# Altium project bootleg-alps.PrjPcb
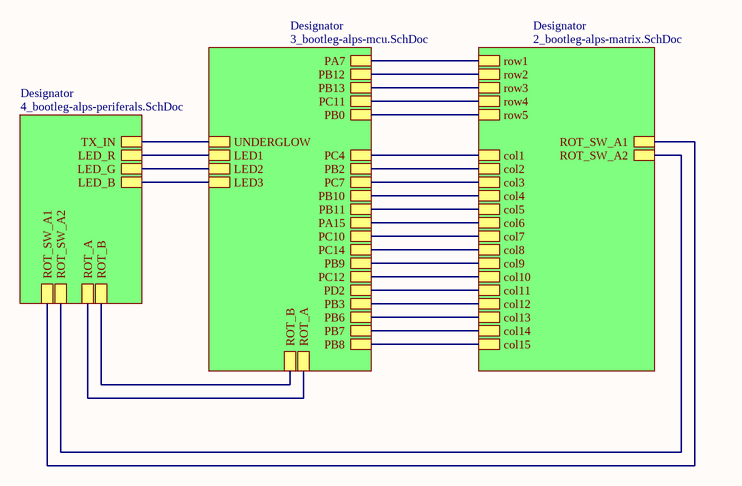
[diagram p0: 1_bootleg-alps_top.SchDoc]
ProjectTitle: bootlegs; Revision: B2 - MX
4 sheets, 188 parts. Net scope: hierarchical (ports join the sheet entries above them; power ports are global).
Board file: bootleg-alps.PcbDoc
Sheets:
  1_bootleg-alps_top.SchDoc
    Designator = 3_bootleg-alps-mcu.SchDoc
    Designator = 2_bootleg-alps-matrix.SchDoc
    Designator = 4_bootleg-alps-periferals.SchDoc

## Sheet 1_bootleg-alps_top.SchDoc: =ProjectTitle
size A4; Address1: github.com/4pplet/bootlegs; Address2: Licence: CERN-OHL-S; Address4: www.4pplet.com; Revision: B2 - MX; SheetNumber: 1; SheetTotal: 4; ProjectName: waffling60

### Sub-sheets
Designator = 3_bootleg-alps-mcu.SchDoc: PB10, PB3, PB8, PB9, PC10, PB0, PC11, PB7, PA15, PB6, PC14, PB13, PD2, UNDERGLOW, LED2, LED1, LED3, PC12, PB2, PB12, PB11, ROT_B, ROT_A, PA7, PC7, PC4
Designator = 2_bootleg-alps-matrix.SchDoc: col5, col7, col3, col1, row3, row1, row4, row2, row5, col4, col2, col6, col14, ROT_SW_A1, col10, ROT_SW_A2, col8, col9, col15, col11, col12, col13
Designator = 4_bootleg-alps-periferals.SchDoc: TX_IN, ROT_A, ROT_B, LED_B, LED_R, LED_G, ROT_SW_A1, ROT_SW_A2

### Nets
col1: sheet Designator/PC4, sheet Designator/col1
col2: sheet Designator/PB2, sheet Designator/col2
col3: sheet Designator/PC7, sheet Designator/col3
col4: sheet Designator/PB10, sheet Designator/col4
col5: sheet Designator/PB11, sheet Designator/col5
col6: sheet Designator/PA15, sheet Designator/col6
col7: sheet Designator/PC10, sheet Designator/col7
col8: sheet Designator/PC14, sheet Designator/col8
col9: sheet Designator/PB9, sheet Designator/col9
col10: sheet Designator/PC12, sheet Designator/col10
col11: sheet Designator/PD2, sheet Designator/col11
col12: sheet Designator/PB3, sheet Designator/col12
col13: sheet Designator/PB6, sheet Designator/col13
col14: sheet Designator/PB7, sheet Designator/col14
col15: sheet Designator/PB8, sheet Designator/ROT_SW_A2, sheet Designator/col15, sheet Designator/ROT_SW_A2
ENC_A: sheet Designator/ROT_A, sheet Designator/ROT_A
ENC_B: sheet Designator/ROT_B, sheet Designator/ROT_B
PA7: sheet Designator/PA7, sheet Designator/row1
PA8: sheet Designator/LED3, sheet Designator/LED_B
PA9: sheet Designator/LED1, sheet Designator/LED_R
PA10: sheet Designator/LED2, sheet Designator/LED_G
PB0: sheet Designator/PB0, sheet Designator/row5
PB12: sheet Designator/PB12, sheet Designator/row2
PB13: sheet Designator/PB13, sheet Designator/row3
PC11: sheet Designator/PC11, sheet Designator/row4
ROT_SW_A1: sheet Designator/ROT_SW_A1, sheet Designator/ROT_SW_A1
NetLED402_4: sheet Designator/UNDERGLOW, sheet Designator/TX_IN

### Notes on the sheet
- Title
- Size:
- Date:
- A4
- Number:
- Time:
- Revision:
- Sheet
- of
- File:

## Sheet 3_bootleg-alps-mcu.SchDoc: =ProjectTitle
size A4; Address1: github.com/4pplet/bootlegs; Address2: Licence: CERN-OHL-S; Address4: www.4pplet.com; Revision: B2 - MX; SheetNumber: 3; SheetTotal: 4
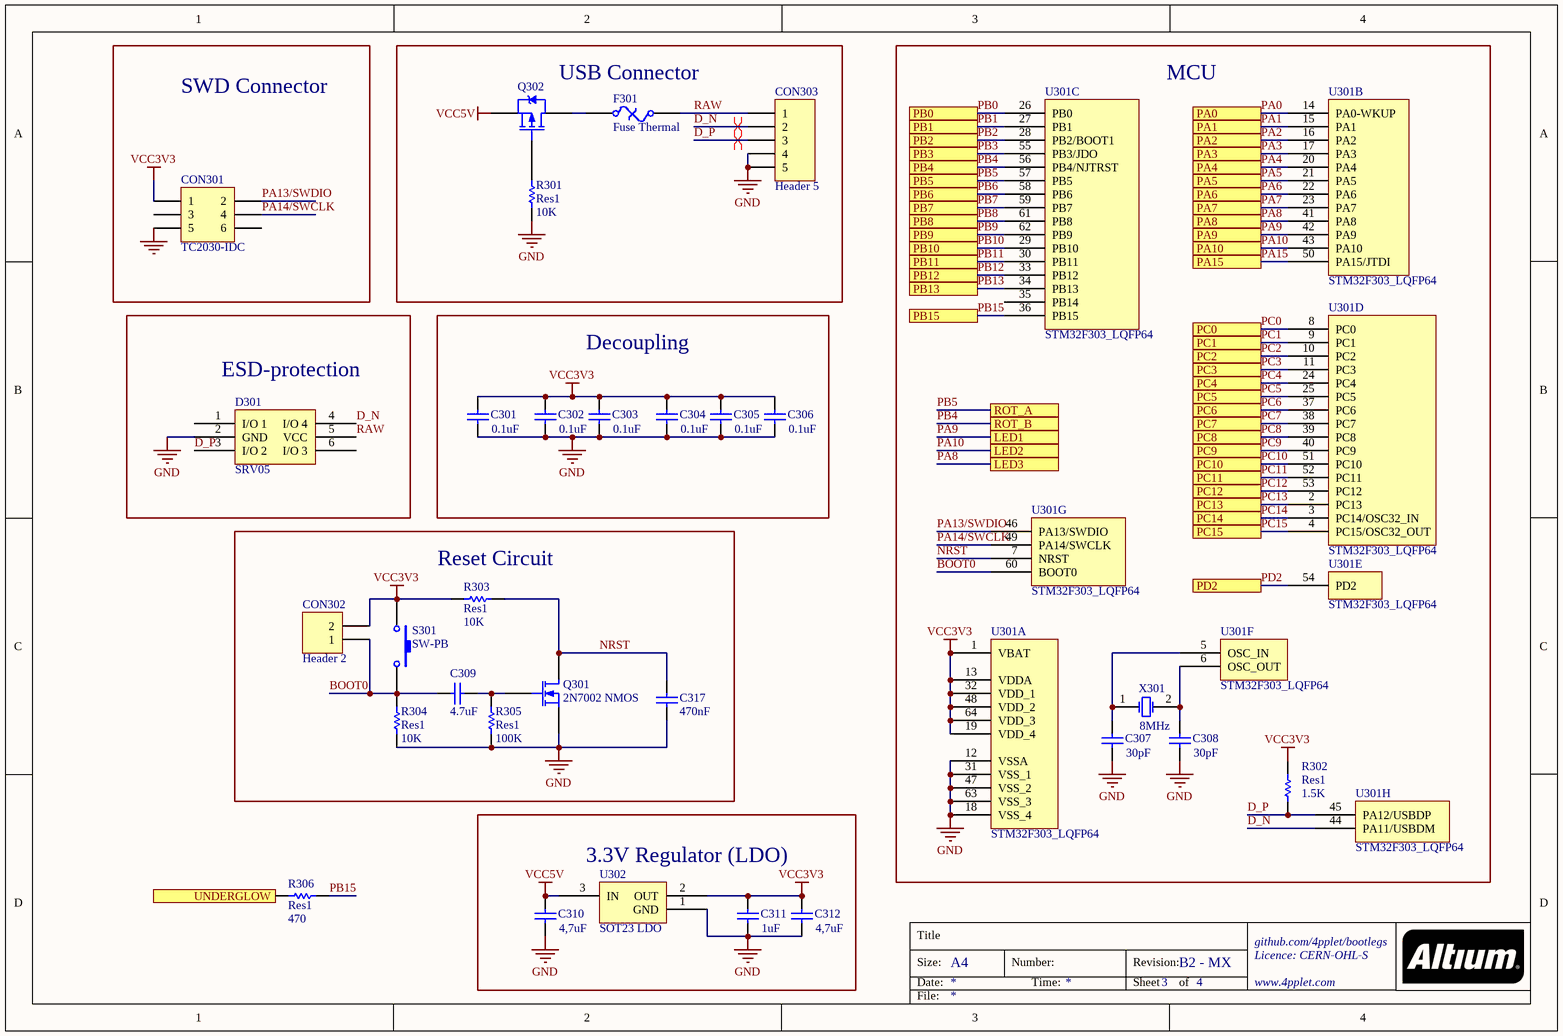
[diagram p1: 3_bootleg-alps-mcu.SchDoc]

### Parts
C301  value 0.1uF  [C0603[1608]]
C302  value 0.1uF  [C0603[1608]]
C303  value 0.1uF  [C0603[1608]]
C304  value 0.1uF  [C0603[1608]]
C305  value 0.1uF  [C0603[1608]]
C306  value 0.1uF  [C0603[1608]]
C307  value 30pF  [C0603[1608]]
C308  value 30pF  [C0603[1608]]
C309  value 4.7uF  [C0603[1608]]
C310  value 4,7uF  [C0603[1608]]
C311  value 1uF  [C0603[1608]]
C312  value 4,7uF  [C0603[1608]]
C317  value 470nF  [C0603[1608]]
CON301  TC2030-IDC  [TC2030-IDC-NL]  (no BOM)
CON302  Header 2  [HDR1X2]  (no BOM)
CON303  Header 5  [JST SM04B-SRSS-TB]
D301  SRV05  [SOT-23-6]
F301  Fuse Thermal  [C1206[3216]]
Q301  2N7002 NMOS  [SOT-23-3]
Q302  PMOS-2  [SOT-23-3]  (value not drawn)
R301  Res1  value 10K  [R0603[1608]]
R302  Res1  value 1.5K  [R0603[1608]]
R303  Res1  value 10K  [R0603[1608]]
R304  Res1  value 10K  [R0603[1608]]
R305  Res1  value 100K  [R0603[1608]]
R306  Res1  value 470  [R0603[1608]]
S301  SW-PB  [XKB Switch]
U301  STM32F303_LQFP64  [STM32 - LQFP64, 10x10mm]  (parts A,B,C,D,E,F,G,H of 8)
U302  SOT23 LDO  [SOT-23-3]
X301  value 8MHz  [CTS 445-series crystal]  (hidden comment: XTAL)

### Blocks framed on the sheet
SWD Connector: CON301
USB Connector: CON303 F301 Q302 R301
MCU: C307 C308 R302 U301 X301
ESD-protection: D301
Decoupling: C301-C306
Reset Circuit: C309 C317 CON302 Q301 R303-R305 S301
3.3V Regulator (LDO): C310-C312 U302

### Ports
LED1, LED2, LED3, PA0, PA1, PA2, PA3, PA4, PA5, PA6, PA7, PA8, PA9, PA10, PA15, PB0, PB1, PB2, PB3, PB4, PB5, PB6, PB7, PB8, PB9, PB10, PB11, PB12, PB13, PB15, PC0, PC1, PC2, PC3, PC4, PC5, PC6, PC7, PC8, PC9, PC10, PC11, PC12, PC13, PC14, PC15, PD2, ROT_A, ROT_B, UNDERGLOW

### Nets
GND: C301.1 C302.1 C303.1 C304.1 C305.1 C306.1 C307.1 C308.1 C310.1 C311.1 C312.1 C317.2 CON301.5 CON303.4 CON303.5 D301.2(GND) Q301.2(S) R301.2 R304.2 R305.2 U301.12(VSSA) U301.18(VSS_4) U301.31(VSS_1) U301.47(VSS_2) U301.63(VSS_3) U302.1(GND)
VCC3V3: C301.2 C302.2 C303.2 C304.2 C305.2 C306.2 C311.2 C312.2 CON301.1 CON302.2 R302.1 R303.1 S301.1 U301.1(VBAT) U301.13(VDDA) U301.19(VDD_4) U301.32(VDD_1) U301.48(VDD_2) U301.64(VDD_3) U302.2(OUT)
VCC5V: C310.2 Q302.2(S) U302.3(IN)
BOOT0: C309.1 CON302.1 R304.1 S301.2 U301.60(BOOT0)
D_N: CON303.2 D301.4(I/O_4) U301.44(PA11/USBDM)
D_P: CON303.3 D301.3(I/O_2) R302.2 U301.45(PA12/USBDP)
NRST: C317.1 Q301.3(D) R303.2 U301.7(NRST)
PA0: U301.14(PA0-WKUP) ; port PA0
PA1: U301.15(PA1) ; port PA1
PA2: U301.16(PA2) ; port PA2
PA3: U301.17(PA3) ; port PA3
PA4: U301.20(PA4) ; port PA4
PA5: U301.21(PA5) ; port PA5
PA6: U301.22(PA6) ; port PA6
PA7: U301.23(PA7) ; port PA7
PA8: U301.41(PA8) ; port LED3, port PA8
PA9: U301.42(PA9) ; port LED1, port PA9
PA10: U301.43(PA10) ; port LED2, port PA10
PA13/SWDIO: CON301.2 U301.46(PA13/SWDIO)
PA14/SWCLK: CON301.4 U301.49(PA14/SWCLK)
PA15: U301.50(PA15/JTDI) ; port PA15  [project net col6]
PB0: U301.26(PB0) ; port PB0
PB1: U301.27(PB1) ; port PB1
PB2: U301.28(PB2/BOOT1) ; port PB2  [project net col2]
PB3: U301.55(PB3/JDO) ; port PB3  [project net col12]
PB4: U301.56(PB4/NJTRST) ; port ROT_B, port PB4  [project net ENC_B]
PB5: U301.57(PB5) ; port ROT_A, port PB5  [project net ENC_A]
PB6: U301.58(PB6) ; port PB6  [project net col13]
PB7: U301.59(PB7) ; port PB7  [project net col14]
PB8: U301.61(PB8) ; port PB8  [project net col15]
PB9: U301.62(PB9) ; port PB9  [project net col9]
PB10: U301.29(PB10) ; port PB10  [project net col4]
PB11: U301.30(PB11) ; port PB11  [project net col5]
PB12: U301.33(PB12) ; port PB12
PB13: U301.34(PB13) ; port PB13
PB15: R306.2 U301.36(PB15) ; port PB15
PC0: U301.8(PC0) ; port PC0
PC1: U301.9(PC1) ; port PC1
PC2: U301.10(PC2) ; port PC2
PC3: U301.11(PC3) ; port PC3
PC4: U301.24(PC4) ; port PC4  [project net col1]
PC5: U301.25(PC5) ; port PC5
PC6: U301.37(PC6) ; port PC6
PC7: U301.38(PC7) ; port PC7  [project net col3]
PC8: U301.39(PC8) ; port PC8
PC9: U301.40(PC9) ; port PC9
PC10: U301.51(PC10) ; port PC10  [project net col7]
PC11: U301.52(PC11) ; port PC11
PC12: U301.53(PC12) ; port PC12  [project net col10]
PC13: U301.2(PC13) ; port PC13
PC14: U301.3(PC14/OSC32_IN) ; port PC14  [project net col8]
PC15: U301.4(PC15/OSC32_OUT) ; port PC15
PD2: U301.54(PD2) ; port PD2  [project net col11]
RAW: CON303.1 D301.5(VCC) F301.2
NetC307_2: C307.2 U301.5(OSC_IN) X301.1(OSC1)
NetC308_2: C308.2 U301.6(OSC_OUT) X301.2(OSC2)
NetC309_2: C309.2 Q301.1(G) R305.1
NetF301_1: F301.1 Q302.3(D)
NetLED402_4: R306.1 ; port UNDERGLOW
NetQ302_1: Q302.1(G) R301.1

Not connected (* = marked no-connect by the designer): CON301 3 6; D301 1(I/O_1) 6(I/O_3); U301 35(PB14)

### Layout directives
differential pair: D_N, D_P

### Notes on the sheet
- Title
- Size:
- Date:
- A4
- Number:
- Time:
- Revision:
- Sheet
- of
- File:

### Library data of the parts
C301-C306 C317 = Cap: Capacitor; MRF.Part: CC0603KRX7R9BB104; MFG: KEMET; MFGPN: C0603C104M5RACTU; LCSC MFG: YAGEO; Version: 0603 imperial; LCSC Part #: C14663
C307 C308 = Cap: Capacitor; MRF.Part: CL10C300JB8NNNC; LCSC MFG: Samsung Electro-Mechanics; Version: 0603 imperial; LCSC Part #: C22397
C309 C310 C312 = Cap: Capacitor; LCSC MFG: Samsung Electro-Mechanics; LCSC Part #: C19666
  C309: Version: 0603 imperial
C311 = Cap: Capacitor; MRF.Part: CL10A105KB8NNNC; MFG: KEMET; MFGPN: C0603C104M5RACTU; LCSC MFG: Samsung Electro-Mechanics; Version: 0603 imperial; LCSC Part #: C15849
CON301 = Header 3X2: Header, 3-Pin, Dual row
CON302 = Header 2: Header, 2-Pin
CON303 = Header 5: JST for USB daughter board; MFGPN: SM04B-SRSS-TB(LF)(SN); MFG: JST Sales America Inc.; LCSC MFG: JST Sales America; LCSC Part #: C160404; MRF.Part: SM04B-SRSS-TB(LF)(SN)
D301 = SRV05: MRF.Part: SRV05-4-P-T7; LCSC MFG: ProTek Devices; LCSC Part #: C85364
F301 = Fuse Thermal: Thermal Fuse; MRF.Part: ASMD1206-050; MFG: Bel Fuse Inc.; MFGPN: 0ZCJ0050FF2G; LCSC MFG: Shenzhen JDT Fuse; LCSC Part #: C135338
Q301 = MOSFET-N: N-Channel MOSFET; LCSC MFG: Changjiang Electronics Tech (CJ); LCSC Part #: C8545; MRF.Part: 2N7002
Q302 = PMOS-2: P-Channel Power MOSFET; MRF.Part: SI2301CDS-T1-GE3; LCSC MFG: Vishay Intertech; LCSC Part #: C10487; Version: SOT23-3
R301 R303 R304 = Res1: Resistor; MRF.Part: 0603WAF1002T5E; MFG: Panasonic Electronic Components; MFGPN: ERJ-3EKF5101V; LCSC MFG: Uniroyal Elec; Version: 0603 imperial; LCSC Part #: C25804
R302 = Res1: Resistor; MRF.Part: 0603WAF1501T5E; LCSC MFG: Uniroyal Elec; Version: 0603 imperial; LCSC Part #: C22843
R305 = Res1: Resistor; MRF.Part: 0603WAF1003T5E; LCSC MFG: Uniroyal Elec; Version: 0603 imperial; LCSC Part #: C25803
R306 = Res1: Resistor; MRF.Part: 0603WAF4700T5E; MFG: Panasonic Electronic Components; MFGPN: ERJ-3EKF5101V; LCSC MFG: UNI-ROYAL(Uniroyal Elec); Version: 0603 imperial; LCSC Part #: C23179
S301 = SW-PB: Switch; MRF.Part: TS-1187A-C-D-B; MFGPN: PTS645SM43SMTR92 LFS; MFG: C&K; LCSC MFG: XKB Enterprise; LCSC Part #: C318888
U301 = STM32F303_LQFP64: MRF.Part: STM32F303RET6; LCSC MFG: STMicroelectronics; LCSC Part #: C183214; Version: LQFP-64
U302 = SOT23 LDO: MRF.Part: XC6206P332MR; LCSC MFG: Torex Semicon; MFG: Texas Instruments; MFGPN: TPS7A0533PDBZ; LCSC Part #: C5446
X301 = XTAL: Crystal Oscillator; MRF.Part: X50328MSB2GI; LCSC MFG: Yangxing Tech; Version: SMD-5032_2P; LCSC Part #: C115962

## Sheet 2_bootleg-alps-matrix.SchDoc: =ProjectTitle
size A3; Address1: github.com/4pplet/bootlegs; Address2: Licence: CERN-OHL-S; Address4: www.4pplet.com; Revision: B2 - MX; SheetNumber: 2; SheetTotal: 4
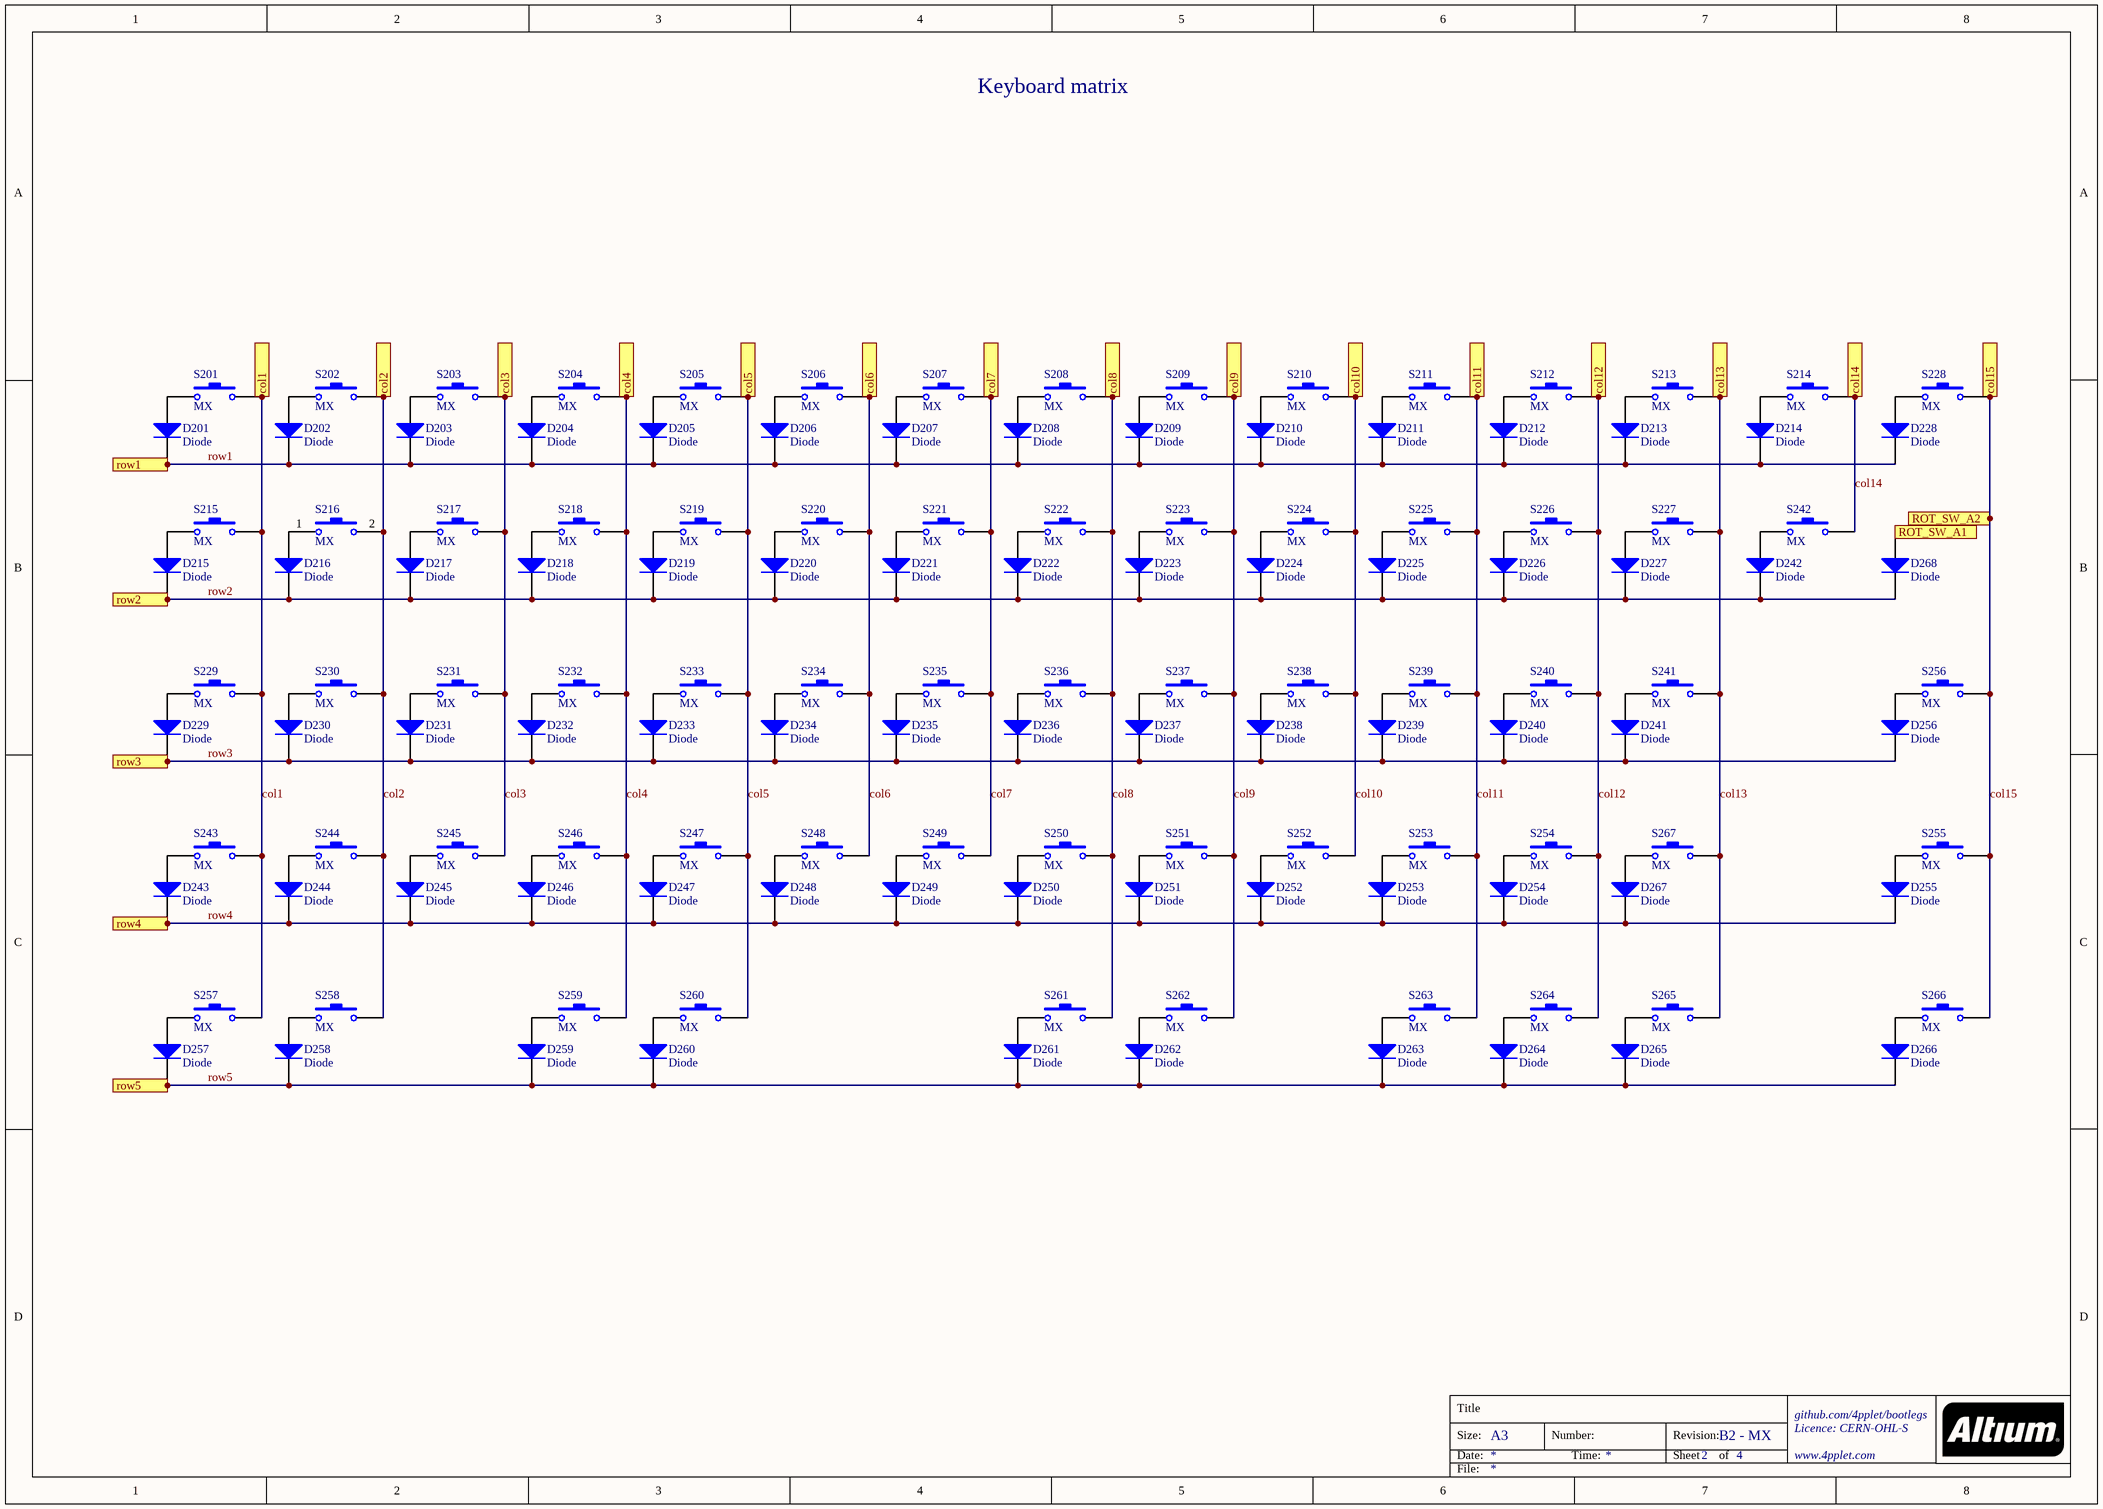
[diagram p2: 2_bootleg-alps-matrix.SchDoc]

### Parts
D201  Diode  [SOD-123]
D202  Diode  [SOD-123]
D203  Diode  [SOD-123]
D204  Diode  [SOD-123]
D205  Diode  [SOD-123]
D206  Diode  [SOD-123]
D207  Diode  [SOD-123]
D208  Diode  [SOD-123]
D209  Diode  [SOD-123]
D210  Diode  [SOD-123]
D211  Diode  [SOD-123]
D212  Diode  [SOD-123]
D213  Diode  [SOD-123]
D214  Diode  [SOD-123]
D215  Diode  [SOD-123]
D216  Diode  [SOD-123]
D217  Diode  [SOD-123]
D218  Diode  [SOD-123]
D219  Diode  [SOD-123]
D220  Diode  [SOD-123]
D221  Diode  [SOD-123]
D222  Diode  [SOD-123]
D223  Diode  [SOD-123]
D224  Diode  [SOD-123]
D225  Diode  [SOD-123]
D226  Diode  [SOD-123]
D227  Diode  [SOD-123]
D228  Diode  [SOD-123]
D229  Diode  [SOD-123]
D230  Diode  [SOD-123]
D231  Diode  [SOD-123]
D232  Diode  [SOD-123]
D233  Diode  [SOD-123]
D234  Diode  [SOD-123]
D235  Diode  [SOD-123]
D236  Diode  [SOD-123]
D237  Diode  [SOD-123]
D238  Diode  [SOD-123]
D239  Diode  [SOD-123]
D240  Diode  [SOD-123]
D241  Diode  [SOD-123]
D242  Diode  [SOD-123]
D243  Diode  [SOD-123]
D244  Diode  [SOD-123]
D245  Diode  [SOD-123]
D246  Diode  [SOD-123]
D247  Diode  [SOD-123]
D248  Diode  [SOD-123]
D249  Diode  [SOD-123]
D250  Diode  [SOD-123]
D251  Diode  [SOD-123]
D252  Diode  [SOD-123]
D253  Diode  [SOD-123]
D254  Diode  [SOD-123]
D255  Diode  [SOD-123]
D256  Diode  [SOD-123]
D257  Diode  [SOD-123]
D258  Diode  [SOD-123]
D259  Diode  [SOD-123]
D260  Diode  [SOD-123]
D261  Diode  [SOD-123]
D262  Diode  [SOD-123]
D263  Diode  [SOD-123]
D264  Diode  [SOD-123]
D265  Diode  [SOD-123]
D266  Diode  [SOD-123]
D267  Diode  [SOD-123]
D268  Diode  [SOD-123]
S201  MX  [Alps-switch - switched pol]  (no BOM)
S202  MX  [Alps-switch]  (no BOM)
S203  MX  [Alps-switch - switched pol]  (no BOM)
S204  MX  [Alps-switch - switched pol]  (no BOM)
S205  MX  [Alps-switch - switched pol]  (no BOM)
S206  MX  [Alps-switch - switched pol]  (no BOM)
S207  MX  [Alps-switch - switched pol]  (no BOM)
S208  MX  [Alps-switch - switched pol]  (no BOM)
S209  MX  [Alps-switch - switched pol]  (no BOM)
S210  MX  [Alps-switch - switched pol]  (no BOM)
S211  MX  [Alps-switch - switched pol]  (no BOM)
S212  MX  [Alps-switch - switched pol]  (no BOM)
S213  MX  [Alps-switch - switched pol]  (no BOM)
S214  MX  [Alps-switch - switched pol]  (no BOM)
S215  MX  [ALPS-switch - 1.5U]  (no BOM)
S216  MX  [Alps-switch - switched pol]  (no BOM)
S217  MX  [Alps-switch - switched pol]  (no BOM)
S218  MX  [Alps-switch - switched pol]  (no BOM)
S219  MX  [Alps-switch - switched pol]  (no BOM)
S220  MX  [Alps-switch - switched pol]  (no BOM)
S221  MX  [Alps-switch - switched pol]  (no BOM)
S222  MX  [Alps-switch - switched pol]  (no BOM)
S223  MX  [Alps-switch - switched pol]  (no BOM)
S224  MX  [Alps-switch - switched pol]  (no BOM)
S225  MX  [Alps-switch - switched pol]  (no BOM)
S226  MX  [Alps-switch]  (no BOM)
S227  MX  [Alps-switch - switched pol]  (no BOM)
S228  MX  [ALPS-switch - backspace]  (no BOM)
S229  MX  [ALPS-switch - CAPS]  (no BOM)
S230  MX  [Alps-switch - switched pol]  (no BOM)
S231  MX  [Alps-switch - switched pol]  (no BOM)
S232  MX  [Alps-switch - switched pol]  (no BOM)
S233  MX  [Alps-switch - switched pol]  (no BOM)
S234  MX  [Alps-switch - switched pol]  (no BOM)
S235  MX  [Alps-switch - switched pol]  (no BOM)
S236  MX  [Alps-switch - switched pol]  (no BOM)
S237  MX  [Alps-switch - switched pol]  (no BOM)
S238  MX  [Alps-switch - switched pol]  (no BOM)
S239  MX  [Alps-switch]  (no BOM)
S240  MX  [Alps-switch - switched pol]  (no BOM)
S241  MX  [Alps-switch]  (no BOM)
S242  MX  [ALPS-switch - 1.5U]  (no BOM)
S243  MX  [ALPS-switch - Left shift v2]  (no BOM)
S244  MX  [Alps-switch]  (no BOM)
S245  MX  [Alps-switch - switched pol]  (no BOM)
S246  MX  [Alps-switch - switched pol]  (no BOM)
S247  MX  [Alps-switch - switched pol]  (no BOM)
S248  MX  [Alps-switch - switched pol]  (no BOM)
S249  MX  [Alps-switch - switched pol]  (no BOM)
S250  MX  [Alps-switch - switched pol]  (no BOM)
S251  MX  [Alps-switch - switched pol]  (no BOM)
S252  MX  [Alps-switch - switched pol]  (no BOM)
S253  MX  [Alps-switch - switched pol]  (no BOM)
S254  MX  [Alps-switch - switched pol]  (no BOM)
S255  MX  [Alps-switch]  (no BOM)
S256  MX  [ALPS-switch - Enter - rotated stab]  (no BOM)
S257  MX  [ALPS-switch - 1.5u MOD-L]  (no BOM)
S258  MX  [ALPS-switch - 1.5u MOD-L]  (no BOM)
S259  MX  [ALPS-switch - 1.5u MOD-L]  (no BOM)
S260  MX  [ALPS-switch - L split space_V3]  (no BOM)
S261  MX  [ALPS-switch - Space_V3]  (no BOM)
S262  MX  [ALPS-switch - R split space_V3]  (no BOM)
S263  MX  [Alps-switch]  (no BOM)
S264  MX  [ALPS-switch - 1.5u MOD-R]  (no BOM)
S265  MX  [ALPS-switch - 1.5u MOD-R]  (no BOM)
S266  MX  [ALPS-switch - 1.5u MOD-R]  (no BOM)
S267  MX  [ALPS-switch - right shift - stabs]  (no BOM)

### Ports
col1, col2, col3, col4, col5, col6, col7, col8, col9, col10, col11, col12, col13, col14, col15, ROT_SW_A1, ROT_SW_A2, row1, row2, row3, row4, row5

### Nets
col1: S201.2 S215.1 S229.2 S243.2 S257.1 ; port col1
col2: S202.2 S216.2 S230.2 S244.2 S258.2 ; port col2
col3: S203.2 S217.2 S231.2 S245.2 ; port col3
col4: S204.2 S218.2 S232.2 S246.2 S259.2 ; port col4
col5: S205.2 S219.2 S233.2 S247.2 S260.2 ; port col5
col6: S206.2 S220.2 S234.2 S248.2 ; port col6
col7: S207.2 S221.2 S235.2 S249.2 ; port col7
col8: S208.2 S222.2 S236.2 S250.2 S261.2 ; port col8
col9: S209.2 S223.2 S237.2 S251.2 S262.2 ; port col9
col10: S210.2 S224.2 S238.2 S252.2 ; port col10
col11: S211.2 S225.2 S239.2 S253.2 S263.2 ; port col11
col12: S212.2 S226.2 S240.2 S254.2 S264.1 ; port col12
col13: S213.2 S227.2 S241.2 S265.2 S267.1 ; port col13
col14: S214.2 S242.2 ; port col14
col15: S228.1 S255.2 S256.2 S266.2 ; port col15, port ROT_SW_A2
ROT_SW_A1: D268.1(A) ; port ROT_SW_A1
row1: D201.2(K) D202.2(K) D203.2(K) D204.2(K) D205.2(K) D206.2(K) D207.2(K) D208.2(K) D209.2(K) D210.2(K) D211.2(K) D212.2(K) D213.2(K) D214.2(K) D228.2(K) ; port row1  [project net PA7]
row2: D215.2(K) D216.2(K) D217.2(K) D218.2(K) D219.2(K) D220.2(K) D221.2(K) D222.2(K) D223.2(K) D224.2(K) D225.2(K) D226.2(K) D227.2(K) D242.2(K) D268.2(K) ; port row2  [project net PB12]
row3: D229.2(K) D230.2(K) D231.2(K) D232.2(K) D233.2(K) D234.2(K) D235.2(K) D236.2(K) D237.2(K) D238.2(K) D239.2(K) D240.2(K) D241.2(K) D256.2(K) ; port row3  [project net PB13]
row4: D243.2(K) D244.2(K) D245.2(K) D246.2(K) D247.2(K) D248.2(K) D249.2(K) D250.2(K) D251.2(K) D252.2(K) D253.2(K) D254.2(K) D255.2(K) D267.2(K) ; port row4  [project net PC11]
row5: D257.2(K) D258.2(K) D259.2(K) D260.2(K) D261.2(K) D262.2(K) D263.2(K) D264.2(K) D265.2(K) D266.2(K) ; port row5  [project net PB0]
NetD201_1: D201.1(A) S201.1
NetD202_1: D202.1(A) S202.1
NetD203_1: D203.1(A) S203.1
NetD204_1: D204.1(A) S204.1
NetD205_1: D205.1(A) S205.1
NetD206_1: D206.1(A) S206.1
NetD207_1: D207.1(A) S207.1
NetD208_1: D208.1(A) S208.1
NetD209_1: D209.1(A) S209.1
NetD210_1: D210.1(A) S210.1
NetD211_1: D211.1(A) S211.1
NetD212_1: D212.1(A) S212.1
NetD213_1: D213.1(A) S213.1
NetD214_1: D214.1(A) S214.1
NetD215_1: D215.1(A) S215.2
NetD216_1: D216.1(A) S216.1
NetD217_1: D217.1(A) S217.1
NetD218_1: D218.1(A) S218.1
NetD219_1: D219.1(A) S219.1
NetD220_1: D220.1(A) S220.1
NetD221_1: D221.1(A) S221.1
NetD222_1: D222.1(A) S222.1
NetD223_1: D223.1(A) S223.1
NetD224_1: D224.1(A) S224.1
NetD225_1: D225.1(A) S225.1
NetD226_1: D226.1(A) S226.1
NetD227_1: D227.1(A) S227.1
NetD228_1: D228.1(A) S228.2
NetD229_1: D229.1(A) S229.1
NetD230_1: D230.1(A) S230.1
NetD231_1: D231.1(A) S231.1
NetD232_1: D232.1(A) S232.1
NetD233_1: D233.1(A) S233.1
NetD234_1: D234.1(A) S234.1
NetD235_1: D235.1(A) S235.1
NetD236_1: D236.1(A) S236.1
NetD237_1: D237.1(A) S237.1
NetD238_1: D238.1(A) S238.1
NetD239_1: D239.1(A) S239.1
NetD240_1: D240.1(A) S240.1
NetD241_1: D241.1(A) S241.1
NetD242_1: D242.1(A) S242.1
NetD243_1: D243.1(A) S243.1
NetD244_1: D244.1(A) S244.1
NetD245_1: D245.1(A) S245.1
NetD246_1: D246.1(A) S246.1
NetD247_1: D247.1(A) S247.1
NetD248_1: D248.1(A) S248.1
NetD249_1: D249.1(A) S249.1
NetD250_1: D250.1(A) S250.1
NetD251_1: D251.1(A) S251.1
NetD252_1: D252.1(A) S252.1
NetD253_1: D253.1(A) S253.1
NetD254_1: D254.1(A) S254.1
NetD255_1: D255.1(A) S255.1
NetD256_1: D256.1(A) S256.1
NetD257_1: D257.1(A) S257.2
NetD258_1: D258.1(A) S258.1
NetD259_1: D259.1(A) S259.1
NetD260_1: D260.1(A) S260.1
NetD261_1: D261.1(A) S261.1
NetD262_1: D262.1(A) S262.1
NetD263_1: D263.1(A) S263.1
NetD264_1: D264.1(A) S264.2
NetD265_1: D265.1(A) S265.1
NetD266_1: D266.1(A) S266.1
NetD267_1: D267.1(A) S267.2

### Notes on the sheet
- Keyboard matrix
- Title
- Size:
- Date:
- A3
- Number:
- Time:
- Revision:
- Sheet
- of
- File:

### Library data of the parts
D201-D268 = Diode: Default Diode; MRF.Part: 1N4148W; LCSC MFG: ST(Semtech); Version: SOD-123; LCSC Part #: C81598
S201-S214 S216-S267 = SW-PB: Switch
S215 = SW-PB: TAB

## Sheet 4_bootleg-alps-periferals.SchDoc: =ProjectTitle
size A4; Address1: github.com/4pplet/bootlegs; Address2: Licence: CERN-OHL-S; Address4: www.4pplet.com; Revision: B2 - MX; SheetNumber: 4; SheetTotal: 4
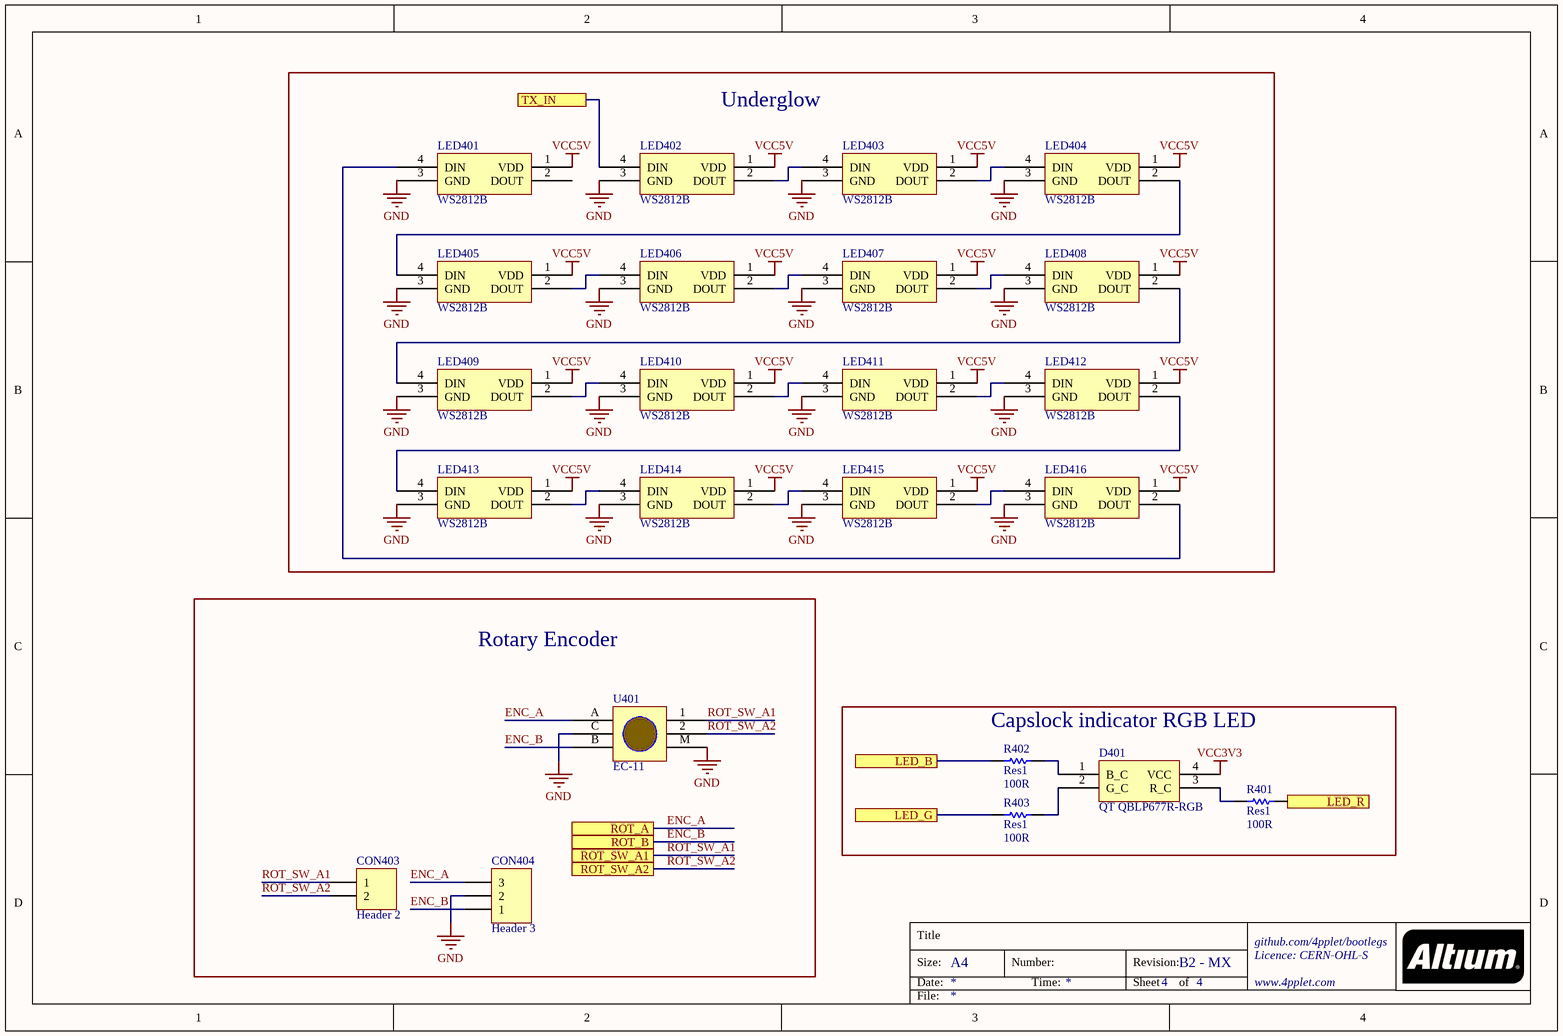
[diagram p3: 4_bootleg-alps-periferals.SchDoc]

### Parts
CON403  Header 2  [HDR1X2]  (no BOM)
CON404  Header 3  [HDR1X3]  (no BOM)
D401  QT QBLP677R-RGB  [QT QBLP677R-RGB]
LED401  WS2812B  [WS2812B - 2020]
LED402  WS2812B  [WS2812B - 2020]
LED403  WS2812B  [WS2812B - 2020]
LED404  WS2812B  [WS2812B - 2020]
LED405  WS2812B  [WS2812B - 2020]
LED406  WS2812B  [WS2812B - 2020]
LED407  WS2812B  [WS2812B - 2020]
LED408  WS2812B  [WS2812B - 2020]
LED409  WS2812B  [WS2812B - 2020]
LED410  WS2812B  [WS2812B - 2020]
LED411  WS2812B  [WS2812B - 2020]
LED412  WS2812B  [WS2812B - 2020]
LED413  WS2812B  [WS2812B - 2020]
LED414  WS2812B  [WS2812B - 2020]
LED415  WS2812B  [WS2812B - 2020]
LED416  WS2812B  [WS2812B - 2020]
R401  Res1  value 100R  [R0603[1608]]
R402  Res1  value 100R  [R0603[1608]]
R403  Res1  value 100R  [R0603[1608]]
U401  EC-11  [EC11-SMD]

### Blocks framed on the sheet
Underglow: LED401-LED416
Rotary Encoder: CON403 CON404 U401
Capslock indicator RGB LED: D401 R401-R403

### Ports
LED_B, LED_G, LED_R, ROT_A, ROT_B, ROT_SW_A1, ROT_SW_A2, TX_IN

### Nets
GND: CON404.2 LED401.3(GND) LED402.3(GND) LED403.3(GND) LED404.3(GND) LED405.3(GND) LED406.3(GND) LED407.3(GND) LED408.3(GND) LED409.3(GND) LED410.3(GND) LED411.3(GND) LED412.3(GND) LED413.3(GND) LED414.3(GND) LED415.3(GND) LED416.3(GND) U401.C U401.M
VCC3V3: D401.4(VCC)
VCC5V: LED401.1(VDD) LED402.1(VDD) LED403.1(VDD) LED404.1(VDD) LED405.1(VDD) LED406.1(VDD) LED407.1(VDD) LED408.1(VDD) LED409.1(VDD) LED410.1(VDD) LED411.1(VDD) LED412.1(VDD) LED413.1(VDD) LED414.1(VDD) LED415.1(VDD) LED416.1(VDD)
ENC_A: CON404.3 U401.A(B) ; port ROT_A
ENC_B: CON404.1 U401.B ; port ROT_B
PA8: R402.2 ; port LED_B
PA9: R401.1 ; port LED_R
PA10: R403.2 ; port LED_G
ROT_SW_A1: CON403.1 U401.1 ; port ROT_SW_A1
ROT_SW_A2: CON403.2 U401.2 ; port ROT_SW_A2  [project net col15]
NetD401_1: D401.1(B_C) R402.1
NetD401_2: D401.2(G_C) R403.1
NetD401_3: D401.3(R_C) R401.2
NetLED401_4: LED401.4(DIN) LED416.2(DOUT)
NetLED402_2: LED402.2(DOUT) LED403.4(DIN)
NetLED402_4: LED402.4(DIN) ; port TX_IN
NetLED403_2: LED403.2(DOUT) LED404.4(DIN)
NetLED404_2: LED404.2(DOUT) LED405.4(DIN)
NetLED405_2: LED405.2(DOUT) LED406.4(DIN)
NetLED406_2: LED406.2(DOUT) LED407.4(DIN)
NetLED407_2: LED407.2(DOUT) LED408.4(DIN)
NetLED408_2: LED408.2(DOUT) LED409.4(DIN)
NetLED409_2: LED409.2(DOUT) LED410.4(DIN)
NetLED410_2: LED410.2(DOUT) LED411.4(DIN)
NetLED411_2: LED411.2(DOUT) LED412.4(DIN)
NetLED412_2: LED412.2(DOUT) LED413.4(DIN)
NetLED413_2: LED413.2(DOUT) LED414.4(DIN)
NetLED414_2: LED414.2(DOUT) LED415.4(DIN)
NetLED415_2: LED415.2(DOUT) LED416.4(DIN)

Not connected (* = marked no-connect by the designer): LED401 2(DOUT)

### Notes on the sheet
- Title
- Size:
- Date:
- A4
- Number:
- Time:
- Revision:
- Sheet
- of
- File:

### Library data of the parts
CON403 = Header 2: Header, 2-Pin
CON404 = Header 3: Header, 3-Pin
D401 = QT QBLP677R-RGB: RGB LED; MFG: QT Brightek (QTB); MFGPN: QBLP677R-RGB; Version: Common Anode RGB LED
LED401-LED416 = WS2812B: MRF.Part: WS2812B-2020; LCSC MFG: Worldsemi; LCSC Part #: C965555
R401-R403 = Res1: Resistor; MRF.Part: 0603WAF1000T5E; LCSC MFG: UNI-ROYAL(Uniroyal Elec); Version: 0603 imperial; LCSC Part #: C22775

## Nets that join several sheets
GND: 3_bootleg-alps-mcu (26 pins), 4_bootleg-alps-periferals (19 pins)
VCC3V3: 3_bootleg-alps-mcu (20 pins), 4_bootleg-alps-periferals (D401.4)
VCC5V: 3_bootleg-alps-mcu (C310.2 Q302.2 U302.3), 4_bootleg-alps-periferals (16 pins)
col1: 3_bootleg-alps-mcu (U301.24), 2_bootleg-alps-matrix (5 pins)
col2: 3_bootleg-alps-mcu (U301.28), 2_bootleg-alps-matrix (5 pins)
col3: 3_bootleg-alps-mcu (U301.38), 2_bootleg-alps-matrix (S203.2 S217.2 S231.2 S245.2)
col4: 3_bootleg-alps-mcu (U301.29), 2_bootleg-alps-matrix (5 pins)
col5: 3_bootleg-alps-mcu (U301.30), 2_bootleg-alps-matrix (5 pins)
col6: 3_bootleg-alps-mcu (U301.50), 2_bootleg-alps-matrix (S206.2 S220.2 S234.2 S248.2)
col7: 3_bootleg-alps-mcu (U301.51), 2_bootleg-alps-matrix (S207.2 S221.2 S235.2 S249.2)
col8: 3_bootleg-alps-mcu (U301.3), 2_bootleg-alps-matrix (5 pins)
col9: 3_bootleg-alps-mcu (U301.62), 2_bootleg-alps-matrix (5 pins)
col10: 3_bootleg-alps-mcu (U301.53), 2_bootleg-alps-matrix (S210.2 S224.2 S238.2 S252.2)
col11: 3_bootleg-alps-mcu (U301.54), 2_bootleg-alps-matrix (5 pins)
col12: 3_bootleg-alps-mcu (U301.55), 2_bootleg-alps-matrix (5 pins)
col13: 3_bootleg-alps-mcu (U301.58), 2_bootleg-alps-matrix (5 pins)
col14: 3_bootleg-alps-mcu (U301.59), 2_bootleg-alps-matrix (S214.2 S242.2)
col15: 3_bootleg-alps-mcu (U301.61), 2_bootleg-alps-matrix (S228.1 S255.2 S256.2 S266.2), 4_bootleg-alps-periferals (CON403.2 U401.2)
ENC_A: 3_bootleg-alps-mcu (U301.57), 4_bootleg-alps-periferals (CON404.3 U401.A)
ENC_B: 3_bootleg-alps-mcu (U301.56), 4_bootleg-alps-periferals (CON404.1 U401.B)
NetLED402_4: 3_bootleg-alps-mcu (R306.1), 4_bootleg-alps-periferals (LED402.4)
PA7: 3_bootleg-alps-mcu (U301.23), 2_bootleg-alps-matrix (15 pins)
PA8: 3_bootleg-alps-mcu (U301.41), 4_bootleg-alps-periferals (R402.2)
PA9: 3_bootleg-alps-mcu (U301.42), 4_bootleg-alps-periferals (R401.1)
PA10: 3_bootleg-alps-mcu (U301.43), 4_bootleg-alps-periferals (R403.2)
PB0: 3_bootleg-alps-mcu (U301.26), 2_bootleg-alps-matrix (10 pins)
PB12: 3_bootleg-alps-mcu (U301.33), 2_bootleg-alps-matrix (15 pins)
PB13: 3_bootleg-alps-mcu (U301.34), 2_bootleg-alps-matrix (14 pins)
PC11: 3_bootleg-alps-mcu (U301.52), 2_bootleg-alps-matrix (14 pins)
ROT_SW_A1: 2_bootleg-alps-matrix (D268.1), 4_bootleg-alps-periferals (CON403.1 U401.1)